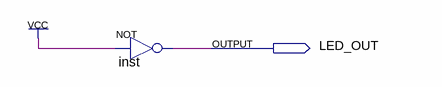
[diagram p0: schematic sheet]
// Quartus schematic LED_NOT.bdf as structural Verilog: 1 symbols, 1 pins
module LED_NOT (
  output LED_OUT
);

  not inst (LED_OUT, 1'b1);
endmodule
